# EAGLE design Inverter - MOSFET (EAGLE 6.2)
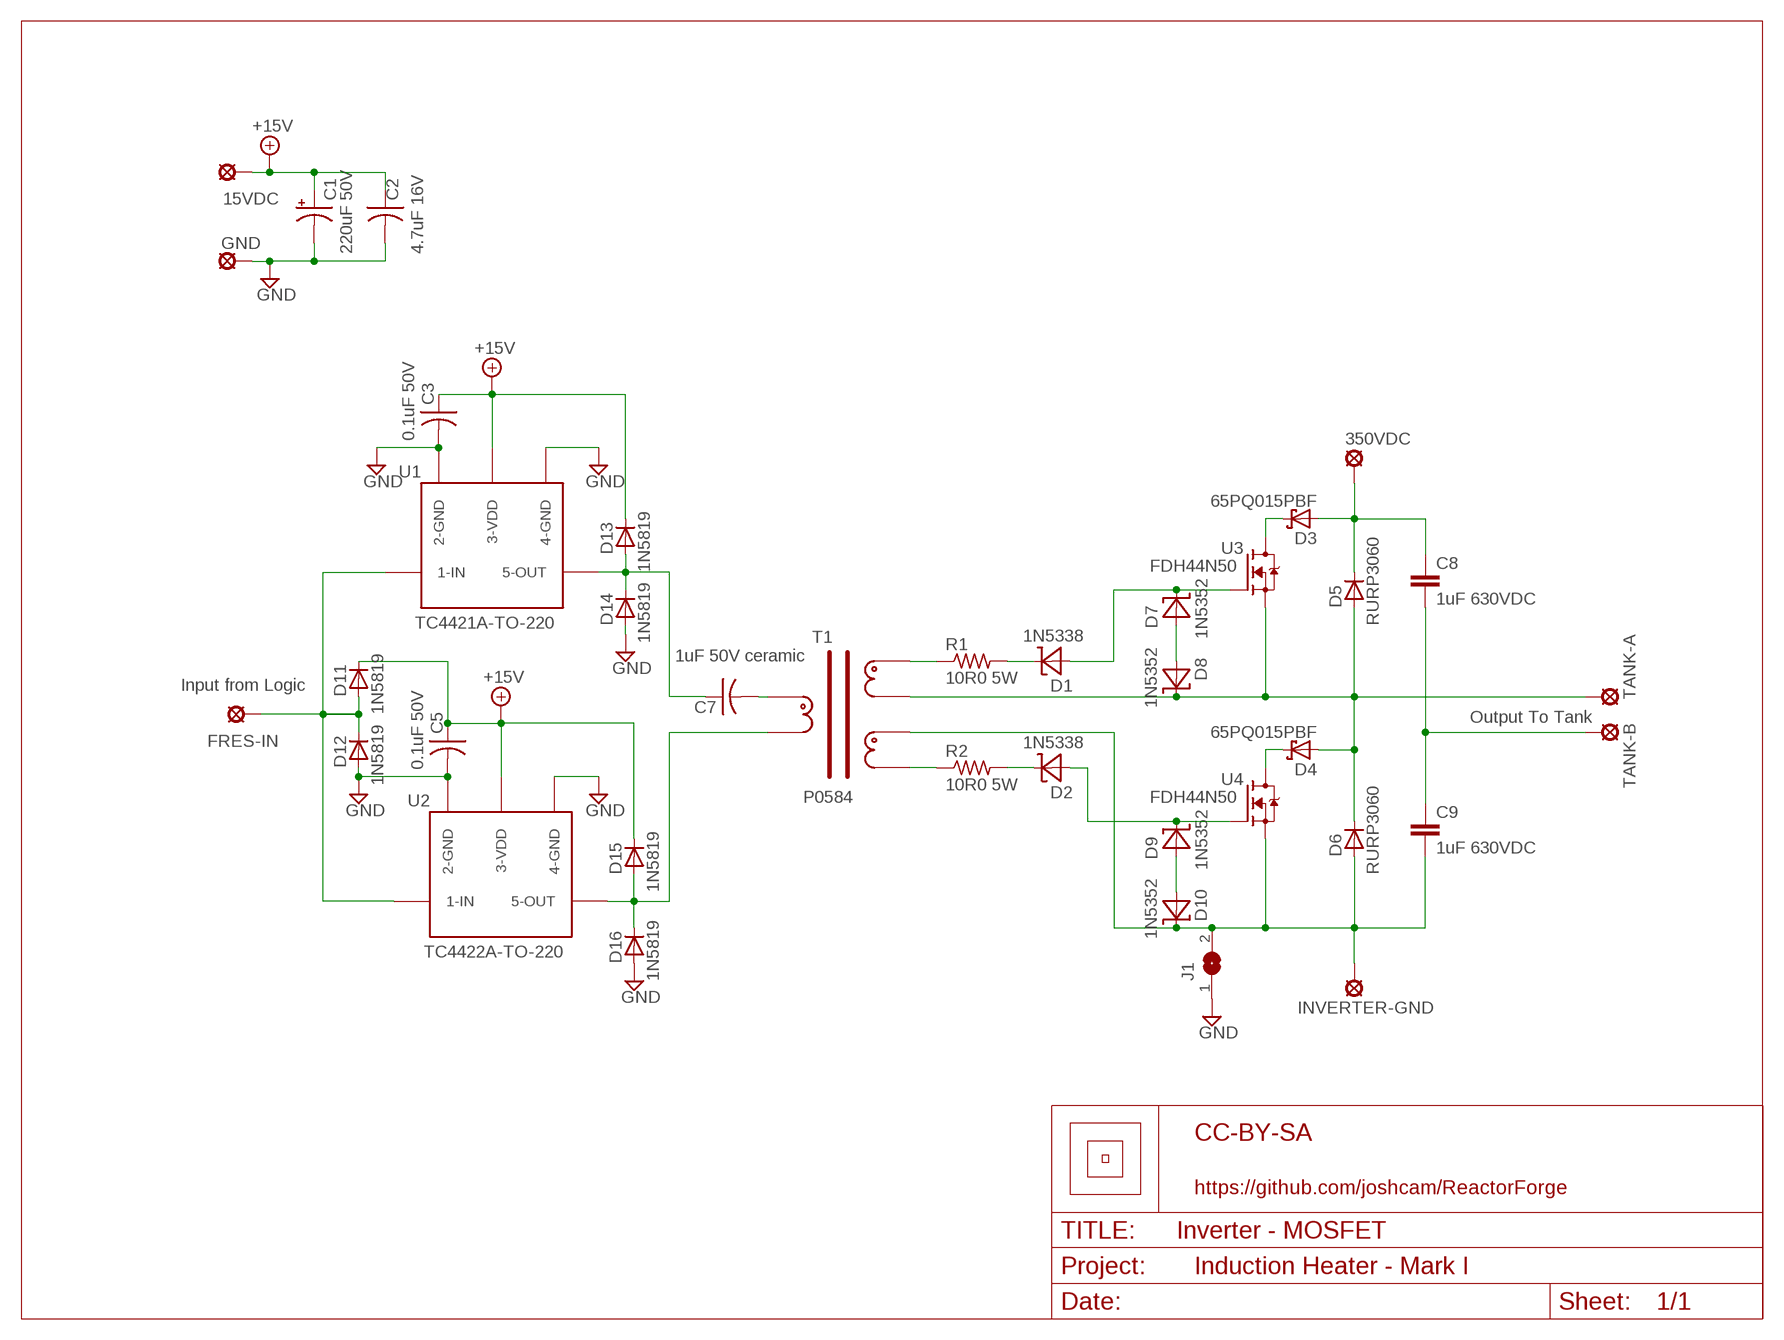
[diagram p0: schematic, sheet 1]
U$1 (LETTER_L): LICENSE: CC-BY-SA; PROJECT: Induction Heater - Mark I; URL: https://github.com/joshcam/ReactorForge

## Parts
15VDC  SE14  [SE14]
350VDC  SE14  [SE14]
C1  220uF 50V  CPOL-USE5-10.5  [E5-10,5]
C2  4.7uF 16V  C-USC1206  [C1206]
C3  0.1uF 50V  C-USC1206  [C1206]
C5  0.1uF 50V  C-USC1206  [C1206]
C7  1uF 50V ceramic  C-USC1206  [C1206]
C8  1uF 630VDC  MKP2000-1UF630V  [CAPACITOR2.2-AXIAL]
C9  1uF 630VDC  MKP2000-1UF630V  [CAPACITOR2.2-AXIAL]
D1  1N5338  [DIODE.4-AXIAL]
D2  1N5338  [DIODE.4-AXIAL]
D3  65PQ015PBF  [TO-247AC-V]
D4  65PQ015PBF  [TO-247AC-V]
D5  RURP3060  [TO-220CA2-V]
D6  RURP3060  [TO-220CA2-V]
D7  1N5352  [DIODE.4-AXIAL]
D8  1N5352  [DIODE.4-AXIAL]
D9  1N5352  [DIODE.4-AXIAL]
D10  1N5352  [DIODE.4-AXIAL]
D11  1N5819  [DIODE.4-AXIAL]
D12  1N5819  [DIODE.4-AXIAL]
D13  1N5819  [DIODE.4-AXIAL]
D14  1N5819  [DIODE.4-AXIAL]
D15  1N5819  [DIODE.4-AXIAL]
D16  1N5819  [DIODE.4-AXIAL]
FRES-IN  SE14  [SE14]
GND  SE14  [SE14]
INVERTER-GND  SE14  [SE14]
J1  SJW  [SJW]
R1  10R0 5W  R-US_0817/22  [P0817/22]
R2  10R0 5W  R-US_0817/22  [P0817/22]
T1  P0584  [P0584]
TANK-A  SE14  [SE14]
TANK-B  SE14  [SE14]
U1  TC4421A-TO-220  [TO-220-8TAB-H]
U2  TC4422A-TO-220  [TO-220-8TAB-H]
U3  FDH44N50  [TO-247-V]
U4  FDH44N50  [TO-247-V]

## Nets
350VDC: 350VDC.MP C8.P$1 D3.1(A) D3.3(A) D5.C
+15V: 15VDC.MP C1.+ C2.1 C3.1 C5.1 D11.C D13.C D15.C U1.3(3-VDD) U1.TAB(3-VDD) U2.3(3-VDD) U2.TAB(3-VDD)
GND1: C1.- C2.2 C3.2 C5.2 D12.A D14.A D16.A GND.MP J1.1 U1.2(2-GND) U1.4(4-GND) U2.2(2-GND) U2.4(4-GND) ; supply symbol labelled GND
INVERTER-GND: C9.P$2 D6.A D10.C INVERTER-GND.MP J1.2 T1.P$8 U4.3(S)
N$1: D11.A D12.C FRES-IN.MP U1.1(1-IN) U2.1(1-IN)
N$2: C7.1 D13.A D14.C U1.5(5-OUT)
N$3: C7.2 T1.P$1
N$4: R1.1 T1.P$3
N$5: D15.A D16.C T1.P$10 U2.5(5-OUT)
N$6: R2.1 T1.P$7
N$7: D1.C R1.2
N$8: D2.C R2.2
N$13: D3.2(C) U3.2(D)
N$14: D4.2(C) U4.2(D)
N$15: D9.A D10.A
N$17: D7.A D8.A
TANK-A: D4.1(A) D4.3(A) D5.A D6.C D8.C T1.P$4 TANK-A.MP U3.3(S)
TANK-B: C8.P$2 C9.P$1 TANK-B.MP
U3-GATE: D1.A D7.C U3.1(G)
U4-GATE: D2.A D9.C U4.1(G)

## Notes on the sheet
- Input from Logic
- Output To Tank

## Library data of the parts
15VDC 350VDC FRES-IN GND INVERTER-GND TANK-A TANK-B = solpad:SE14: SOLDER PAD E1553, drill 1,4mm, distributor Buerklin, 07F820
C1 = rcl:CPOL-US: POLARIZED CAPACITOR, American symbol
C2 C3 C5 C7 = resistor:C-US: CAPACITOR, American symbol
C8 C9 = 1-Custom:MKP2000-1UF630V: MKP2000 1uF 630VDC Metalized Polypropylene Capacitor
D1 D2 = 1-Custom:1N5338: 1N5338 5.1V Zener Diode
D3 D4 = 1-Custom:65PQ015PBF: 65PQ015PBF 65A Schottky Rectifier Lead Free
D5 D6 = 1-Custom:RURP3060: RURP3060 30A 600V Ultrafast Diode 60nS
D7-D10 = 1-Custom:1N5352: 1N5362 15V 5W Zener Diode
D11-D16 = 1-Custom:1N5819: 1N5819 Schottky Diode - 40V 1A
J1 = jumper:SJ: SMD solder JUMPER
R1 R2 = resistor:R-US_: RESISTOR, American symbol
T1 = 1-Custom:P0584: P0584 1:1:1 Offline Gate Drive Transformer 50-500KHz
U1 = 1-Custom:TC4421A-TO-220: TC4421A 10A High-Speed MOSFET Driver - Inverting
U2 = 1-Custom:TC4422A-TO-220: TC4422A 10A High-Speed MOSFET Driver - Non-Inverting
U3 U4 = 1-Custom:FDH44N50: FDH44N50 44A 500V .12Ohm N-Channel SMPS Power MOSFET

## Board
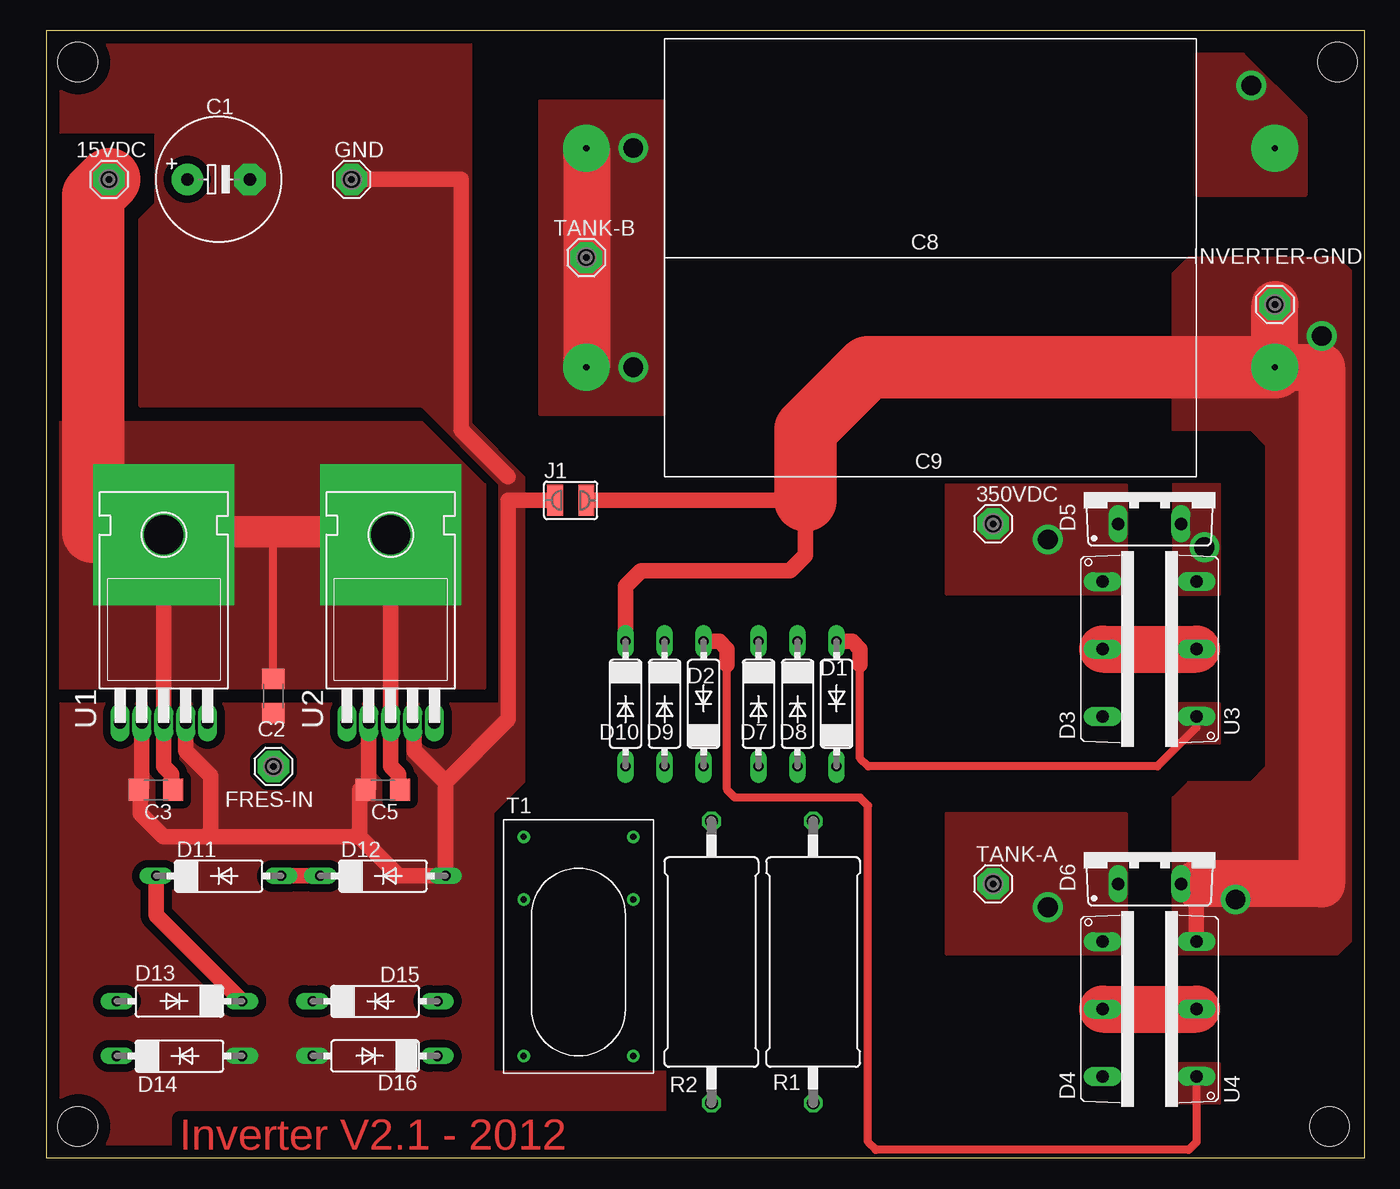
[diagram p1: board, top side]
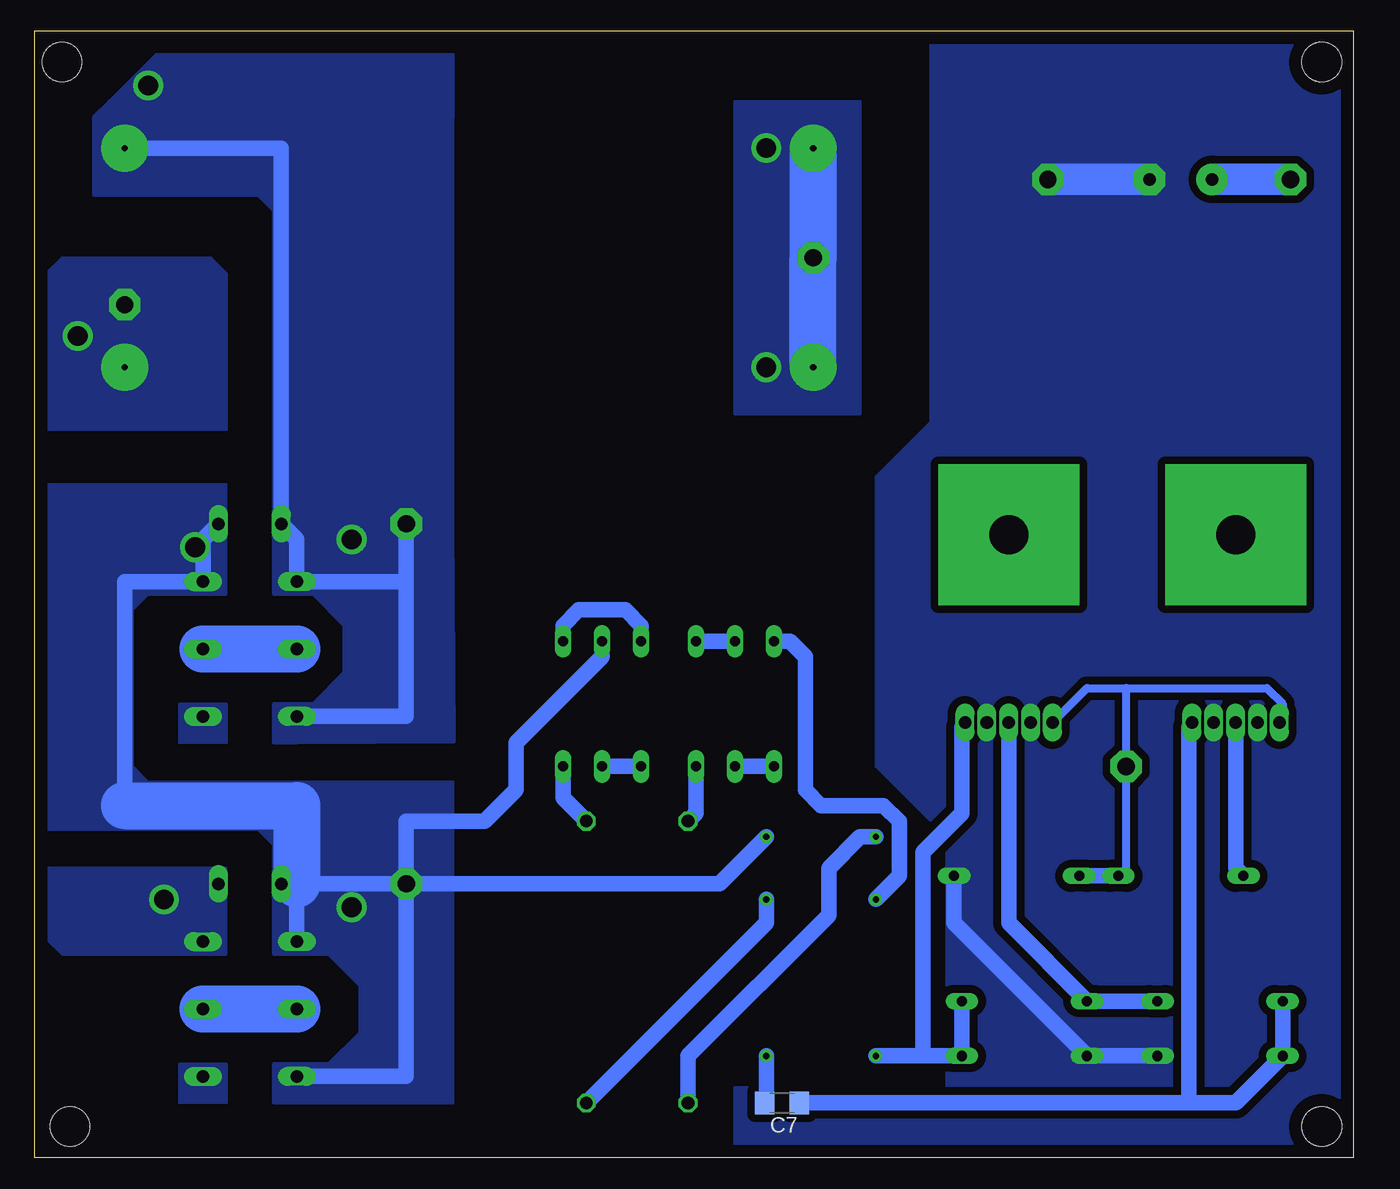
[diagram p2: board, bottom side, seen from below]

Size 106.98 x 91.43 mm. Coordinates in mm from the lower left corner, seen from the top.
Outline: 0,0 106.98,0 106.98,91.43 0,91.43 0,0
Copper layers (1*16): Top 0.035mm / dielectric 1.5mm / Bottom 0.035mm
Design rules: minimum track width 25mil, minimum drill 10mil, track to track 25mil, track to pad 25mil, pad to pad 25mil, via to via 25mil, smd to smd 10mil, copper to edge 40mil, drill to drill 8mil, minimum pad ring 10mil, minimum via ring 8mil, stop-mask expansion 4mil, vias tented up to drill 0mil, thermal gap 10mil
Holes 3.2 mm at 2.54,88.9 2.54,2.54 104.14,2.54 104.78,88.9

### Footprints (pad centres in the part's own frame; a part is rotated, then mirrored left to right if it is on the bottom)
SE14 = drill 1.397 pad 2.54 octagon: MP 0,0
E5-10,5 = drill 1.016 pad 2.54: + -2.54,0 | drill 1.016 pad 2.54 octagon: - 2.54,0
C1206 = smd 1.6 x 1.8: 1 -1.4,0; 2 1.4,0
CAPACITOR2.2-AXIAL = drill 0.5 pad 3.81: P$1 -27.94,0; P$2 27.94,0
DIODE.4-AXIAL = drill 0.813 long: A 5.08,0; C -5.08,0
TO-247AC-V = drill 1.016 long: 1 -5.461,0; 2 0,0; 3 5.461,0
TO-220CA2-V = drill 1.016 long: A 2.54,0; C -2.54,0
SJW = smd 1.27 x 2.54: 1 -1.27,0; 2 1.27,0
P0817/22 = drill 1.016 octagon: 1 -11.43,0; 2 11.43,0
P0584 = drill 0.5 pad 1.016: P$1 -8.89,-4.445; P$3 3.81,-4.445; P$4 8.89,-4.445; P$7 8.89,4.445; P$8 3.81,4.445; P$10 -8.89,4.445
TO-220-8TAB-H = drill 1.016 pad 1.524 long: 1 -3.556,-7.874; 2 -1.778,-7.874; 3 0,-7.874; 4 1.778,-7.874; 5 3.556,-7.874 | drill 3.175 pad 11.43 square: TAB 0,7.366
TO-247-V = drill 1.016 long: 1 -5.461,0; 2 0,0; 3 5.461,0

### Placement (x,y rotation side)
15VDC  5.08,79.38 0 top
350VDC  76.84,51.44 0 top
C1  13.97,79.38 0 top
C2  18.42,37.47 270 top
C3  8.89,29.84 180 top
C5  27.3,29.84 180 top
C7  46.36,4.45 180 bottom
C8  71.75,81.91 180 top
C9  71.75,64.13 0 top
D1  64.13,36.83 90 top
D2  53.34,36.83 90 top
D3  85.72,41.27 270 top
D4  85.72,12.07 270 top
D5  89.53,51.44 0 top
D6  89.53,22.23 0 top
D7  57.79,36.83 270 top
D8  60.96,36.83 270 top
D9  50.16,36.83 270 top
D10  46.99,36.83 270 top
D11  13.97,22.86 0 top
D12  27.3,22.86 0 top
D13  10.79,12.7 180 top
D14  10.79,8.26 0 top
D15  26.67,12.7 0 top
D16  26.67,8.26 180 top
FRES-IN  18.42,31.75 0 top
GND  24.77,79.38 0 top
INVERTER-GND  99.7,69.22 0 top
J1  42.55,53.34 0 top
R1  62.23,15.88 90 top
R2  53.98,15.88 90 top
T1  43.18,17.14 90 top
TANK-A  76.84,22.23 0 top
TANK-B  43.81,73.03 0 top
U1  9.53,43.18 0 top
U2  27.94,43.18 0 top
U3  93.34,41.27 90 top
U4  93.34,12.07 90 top

### Tracks (layer width: path | path; a pad name or v marks a point on that pad's centre or on a via)
350VDC  (via drill 1.6)
  Bottom 1.27: C8.P$1 87,81.91 D5.C 85.72,50.16 D3.1 76.84,46.74 350VDC.MP 76.84,35.81 D3.3
  other vias: 81.28,50.16 97.79,87
  pour Bottom (isolate 0.508, no thermals): 87.63,33.66 85.72,33.66 72.93,33.75 73.03,51.62 73.03,54.61 87.63,54.61 87.63,45.72 84.45,45.72 81.92,43.18 81.92,39.37 84.45,36.83 87.63,36.83
  pour Top (isolate 0.508, no thermals): 87.63,45.72 73.03,45.72 73.03,54.61 87.63,54.61
  pour Bottom (isolate 0.508, no thermals): 73.03,54.61 73.03,84.46 74.3,85.72 100.97,85.72 102.23,84.46 102.23,78.1 87.63,78.1 87.63,54.61
  pour Bottom (isolate 0.508, no thermals): 100.97,85.72 97.16,89.53 73.03,89.53 73.03,84.46 74.3,85.72
  pour Bottom (isolate 0.508, no thermals): 88.9,78.1 87.63,78.1 87.63,76.84
  pour Top (isolate 0.508, no thermals): 102.23,78.1 102.23,84.46 97.16,89.53 93.34,89.53 93.34,78.1
+15V
  Top 0.635: C2.1 18.42,50.8 | 28.58,29.84 C5.1 | 10.16,29.84 C3.1
  Top 1.27: 28.58,29.84 28.58,31.12 27.94,31.75 U2.3 U2.TAB | 10.16,29.84 10.16,31.12 9.53,31.75 U1.3 9.53,50.8 | D11.C 8.89,19.69 D13.C
  Top 2.54: 3.81,50.8 9.53,50.8 | 9.53,50.8 U1.TAB | 9.53,50.8 18.42,50.8 27.94,50.8 U2.TAB
  Top 5.08: 15VDC.MP 3.81,78.1 3.81,50.8
  Bottom 1.27: D13.C D15.C 27.94,19.05 U2.3 | U1.3 9.53,23.5 D11.C
  Bottom 2.54: C1.+ 15VDC.MP
  pour Top (isolate 0.508, no thermals): 0,59.69 30.48,59.69 35.56,54.61 35.56,38.1 0,38.1
GND1
  Top 0.635: 7.62,29.21 7.62,29.84 C3.2 7.75,30.1 | 26.04,29.21 25.4,29.84 C5.2 26.16,29.97
  Top 1.27: GND.MP 33.66,79.38 33.66,59.05 37.47,55.24 | 13.33,26.04 9.53,26.04 7.62,27.94 7.62,29.21 | 25.4,26.04 13.33,26.04 | 25.4,29.84 25.4,26.04 | 7.75,30.1 U1.2 | U1.4 11.3,33.02 13.33,30.99 13.33,26.04 | 26.16,29.97 U2.2 | U2.4 29.85,35.18 29.85,33.02 32.38,30.48 | 25.4,26.04 28.58,22.86 D12.A 32.38,30.48 | 32.38,30.48 37.47,35.56 37.47,53.34 J1.1
  Bottom 1.27: D14.A D16.A 32.38,19.05 D12.A
  Bottom 2.54: C1.- GND.MP
  pour Top (isolate 0.508, no thermals): 0.64,90.81 34.42,90.81 34.41,59.57 38.73,55.24 38.73,30.48 36.2,27.94 36.2,0.64 0.64,0.64 0.64,36.83 36.83,36.83 36.83,54.61 30.48,60.96 7.62,60.96 7.62,76.2 8.89,77.47 8.89,83.19 0.64,83.19
  pour Bottom (isolate 0.508, no thermals): 0.64,90.81 34.29,90.81 34.29,59.69 38.73,55.24 38.73,31.75 33.02,26.04 33.02,4.45 0.64,5.08
  pour Bottom (isolate 0.508, no thermals): 0.64,5.71 0.64,0.64 50.16,0.64 50.16,5.71
  pour Top (isolate 0.508, no thermals): 36.2,6.99 50.16,6.99 50.16,0.64 36.2,0.64
INVERTER-GND  (via drill 1.6)
  Top 1.27: D6.A 93.34,22.23 U4.3 | J1.2 61.59,53.34 61.59,48.9 60.33,47.62 48.26,47.62 46.99,46.35 D10.C
  Top 3.81: 93.34,22.23 103.5,22.23 103.5,64.13 C9.P$2 INVERTER-GND.MP
  Top 5.08: 61.59,53.34 61.59,59.05 66.67,64.13 C9.P$2
  Bottom 1.27: T1.P$8 36.83,22.86 36.83,27.3 38.1,28.57 43.18,28.57 44.45,29.84 44.45,40.64 45.72,41.91 D10.C
  other vias: 103.5,66.67 96.52,20.96
  pour Top (isolate 0.508, no thermals): 91.44,16.51 91.44,29.21 92.71,30.48 97.79,30.48 99.06,31.75 99.06,57.79 97.79,59.05 91.44,59.05 91.44,71.75 92.71,73.03 104.78,73.03 106.05,71.75 106.05,17.78 104.78,16.51
  pour Bottom (isolate 0.508, no thermals): 91.44,16.51 91.44,23.5 106.05,23.5 106.05,17.78 104.78,16.51
  pour Bottom (isolate 0.508, no thermals): 92.71,73.03 91.44,71.75 91.44,59.05 106.05,59.05 106.05,71.75 104.78,73.03
N$1
  Top 1.27: D12.C D11.A
  Bottom 0.635: 18.42,38.1 21.59,38.1 U2.1 | 18.42,38.1 6.99,38.1 5.71,36.83 5.71,35.56 U1.1 | 18.42,38.1 FRES-IN.MP 18.42,23.5 D11.A
  Bottom 1.27: D12.C D11.A
N$2
  Bottom 1.27: 13.33,4.45 9.53,4.45 D14.C D13.A | 13.33,4.45 C7.1 | 13.33,4.45 13.33,34.92 U1.5
N$3
  Bottom 0.635: 47.62,4.45 C7.2
  Bottom 1.27: T1.P$1 47.62,4.45
N$4
  Bottom 1.27: T1.P$3 47.62,19.05 R1.1
N$5
  Bottom 1.27: 34.93,8.26 D16.C D15.A | 34.93,8.26 T1.P$10 | 34.93,8.26 34.93,24.77 31.75,27.94 31.75,34.92 U2.5
N$6
  Bottom 1.27: T1.P$7 40.01,26.04 42.55,23.5 42.55,19.69 53.98,8.26 R2.1
N$7
  Bottom 1.27: D1.C 64.13,29.21 R1.2
N$8
  Bottom 1.27: D2.C 53.34,27.94 R2.2
N$13
  Top 3.81: D3.2 U3.2
  Bottom 3.81: D3.2 U3.2
N$14
  Top 3.81: D4.2 U4.2
  Bottom 3.81: D4.2 U4.2
N$15
  Bottom 1.27: D9.A D10.A
N$17
  Bottom 1.27: D8.A D7.A
TANK-A  (via drill 1.6)
  Bottom 1.27: D5.A 93.34,50.16 U3.3 99.7,46.74 99.7,28.57 | 85.72,22.23 D6.C | D4.1 85.72,22.23 | D4.3 76.84,6.6 TANK-A.MP | TANK-A.MP 85.72,22.23 | TANK-A.MP 76.84,27.3 70.48,27.3 67.95,29.84 67.95,33.66 60.96,40.64 D8.C | T1.P$4 51.44,22.23 TANK-A.MP
  Bottom 3.81: 99.7,28.57 85.72,28.57 85.72,22.23
  other vias: 81.28,20.32 93.98,49.53
  pour Bottom (isolate 0.508, no thermals): 87.63,4.45 73.03,4.45 73.03,30.48 99.06,30.48 99.06,45.72 91.44,45.72 91.44,54.61 106.05,54.61 106.05,26.67 87.63,26.67 87.63,16.51 83.19,16.51 80.64,13.97 80.64,10.16 83.19,7.62 87.63,7.62
  pour Top (isolate 0.508, no thermals): 87.63,16.51 73.03,16.51 73.03,27.94 87.63,27.94
  pour Bottom (isolate 0.508, no thermals): 99.06,31.75 97.79,30.48 99.06,30.48
  pour Bottom (isolate 0.508, no thermals): 97.79,45.72 99.06,44.45 99.06,45.72
  pour Bottom (isolate 0.508, no thermals): 87.63,25.4 88.9,26.67 87.63,26.67
  pour Top (isolate 0.508, no thermals): 91.44,54.61 91.44,45.72 95.25,45.72 95.25,54.61
TANK-B  (via drill 1.6)
  Top 3.81: C8.P$2 C9.P$1
  Bottom 3.81: C8.P$2 TANK-B.MP C9.P$1
  other vias: 47.62,81.91 47.62,64.13
  pour Top (isolate 0.508, no thermals): 50.16,85.72 40.01,85.72 40.01,60.33 50.16,60.33
  pour Bottom (isolate 0.508, no thermals): 50.16,85.72 40.01,85.72 40.01,60.33 50.16,60.33
U3-GATE
  Top 0.635: U3.1 93.34,34.92 90.17,31.75 66.67,31.75 66.04,32.39 66.04,40.01
  Top 1.27: 66.04,40.01 66.04,41.27 65.41,41.91 D1.A
  Bottom 1.27: D1.A 64.13,43.18 62.87,44.45 59.05,44.45 57.79,43.18 D7.C
  pour Top (isolate 0.508, no thermals): 91.44,36.83 91.44,33.66 95.25,33.66 95.25,36.83
  pour Bottom (isolate 0.508, no thermals): 91.44,36.83 91.44,33.66 95.25,33.66 95.25,36.83
U4-GATE
  Top 0.635: U4.1 93.34,1.27 92.71,0.64 67.31,0.64 66.67,1.27 66.67,28.57 66.04,29.21 55.88,29.21 55.25,29.84 55.25,40.01
  Top 1.27: 55.25,40.01 55.25,41.27 54.61,41.91 D2.A
  Bottom 1.27: D2.A D9.C
  pour Bottom (isolate 0.508, no thermals): 91.44,7.62 91.44,4.45 95.25,4.45 95.25,7.62
  pour Top (isolate 0.508, no thermals): 91.44,7.62 91.44,4.45 95.25,4.45 95.25,7.62

### Text on the board
Top: Inverter V2.1 - 2012